# EAGLE schematic synth-zodiac-sagitarius-speaker (EAGLE 9.6.2)
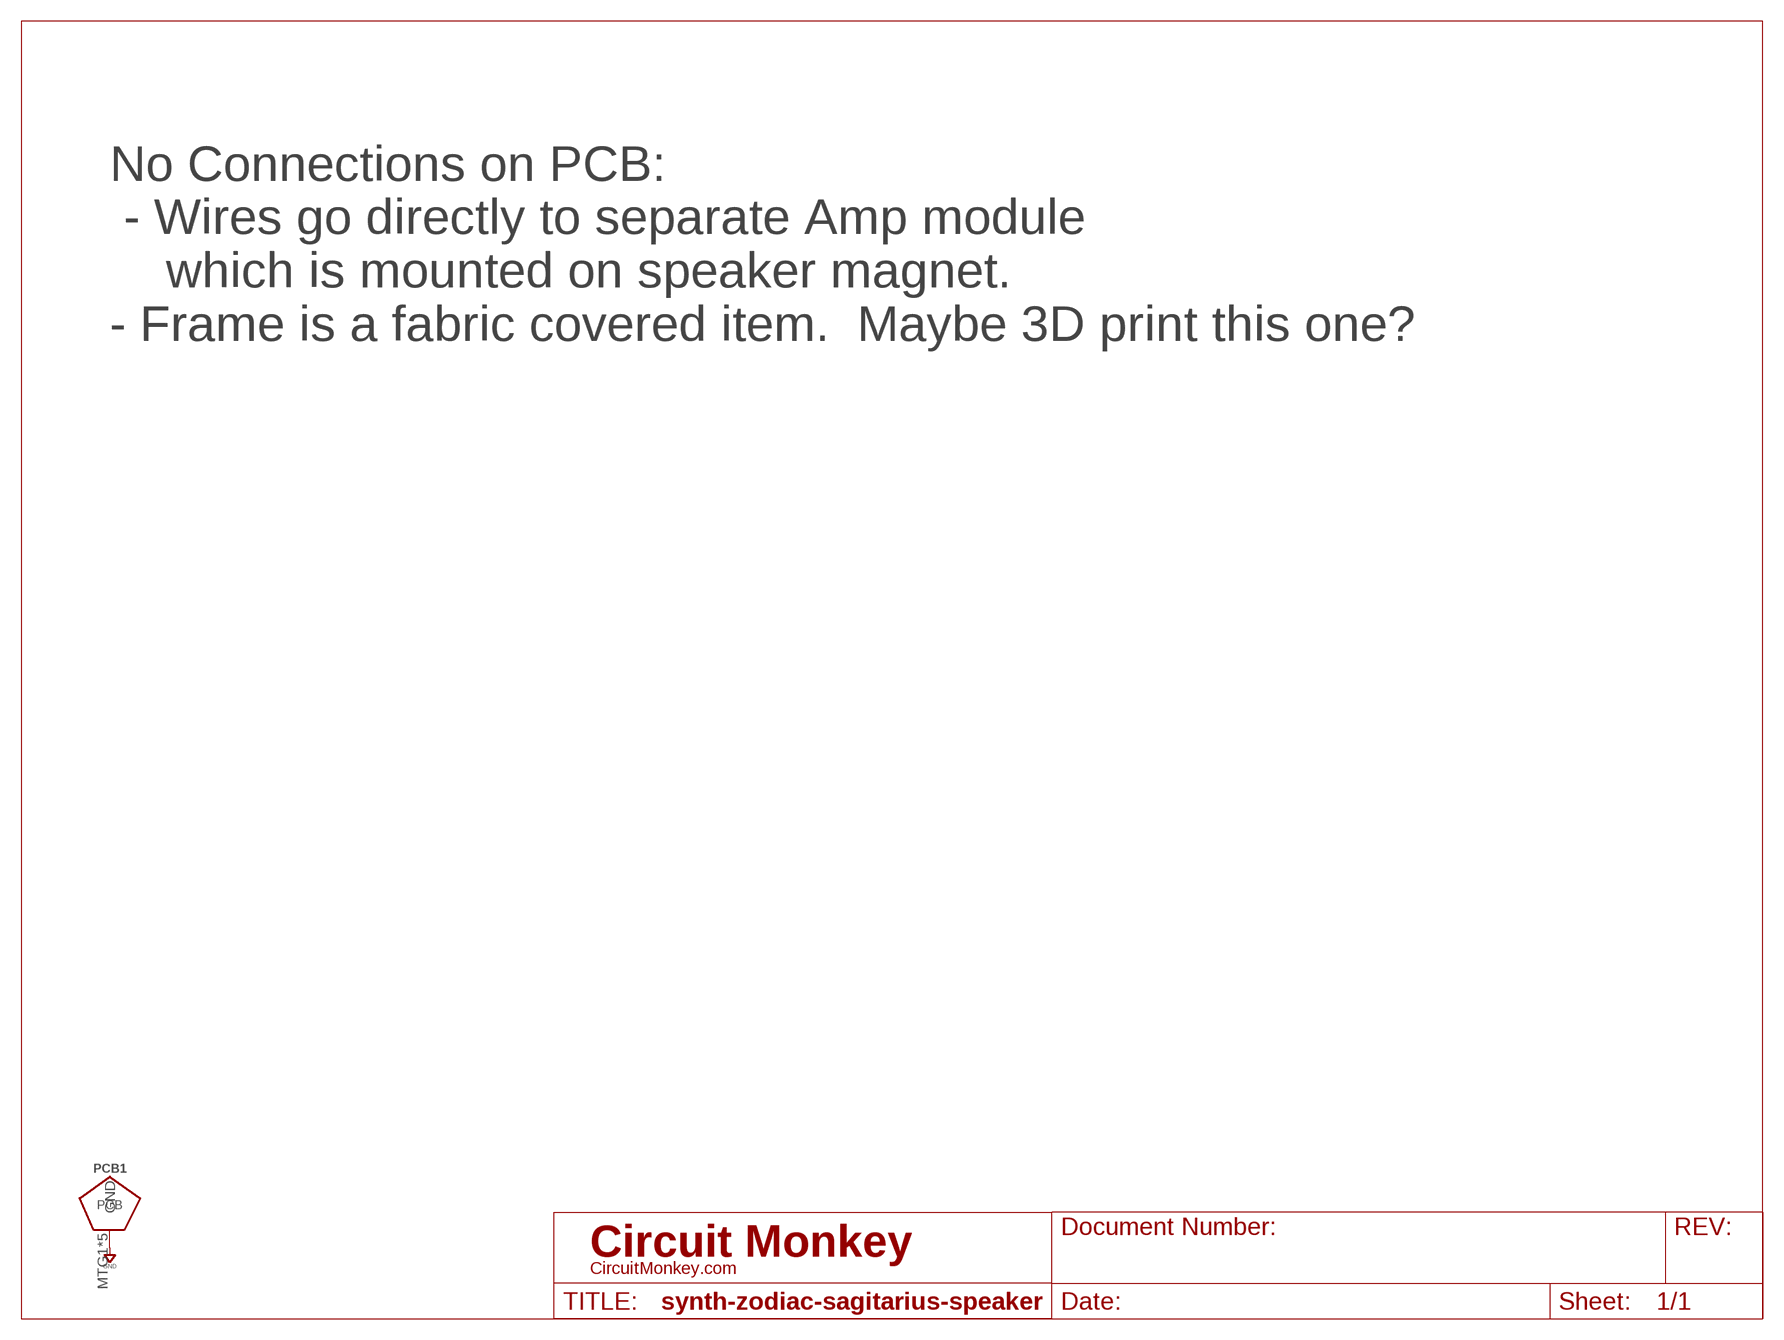
[diagram p0: schematic, sheet 1]

## Parts
PCB1  PCB FAB  PENTAGON-40R  [PENTAGON-40MM-RAD]

## Nets
GND: PCB1.MTG1(GND) PCB1.MTG2(GND) PCB1.MTG3(GND) PCB1.MTG4(GND) PCB1.MTG5(GND)

## Notes on the sheet
- No Connections on PCB:
   - Wires go directly to separate Amp module
      which is mounted on speaker magnet.
  - Frame is a fabric covered item.  Maybe 3D print this one?

## Library data of the parts
PCB1 = circuit-monkey-zodiac:PENTAGON: Pentagram shaped PCB